# Altium schematic sheet 03_Clock_Diagram.SchDoc: Clock diagram
size A4; Organization: Lime Microsystems; Address1: Surrey Tech Centre; Address2: Guildford GU2 7YG; Address3: Surrey; Address4: United Kingdom; Revision: v2.3; SheetNumber: 3; SheetTotal: 10
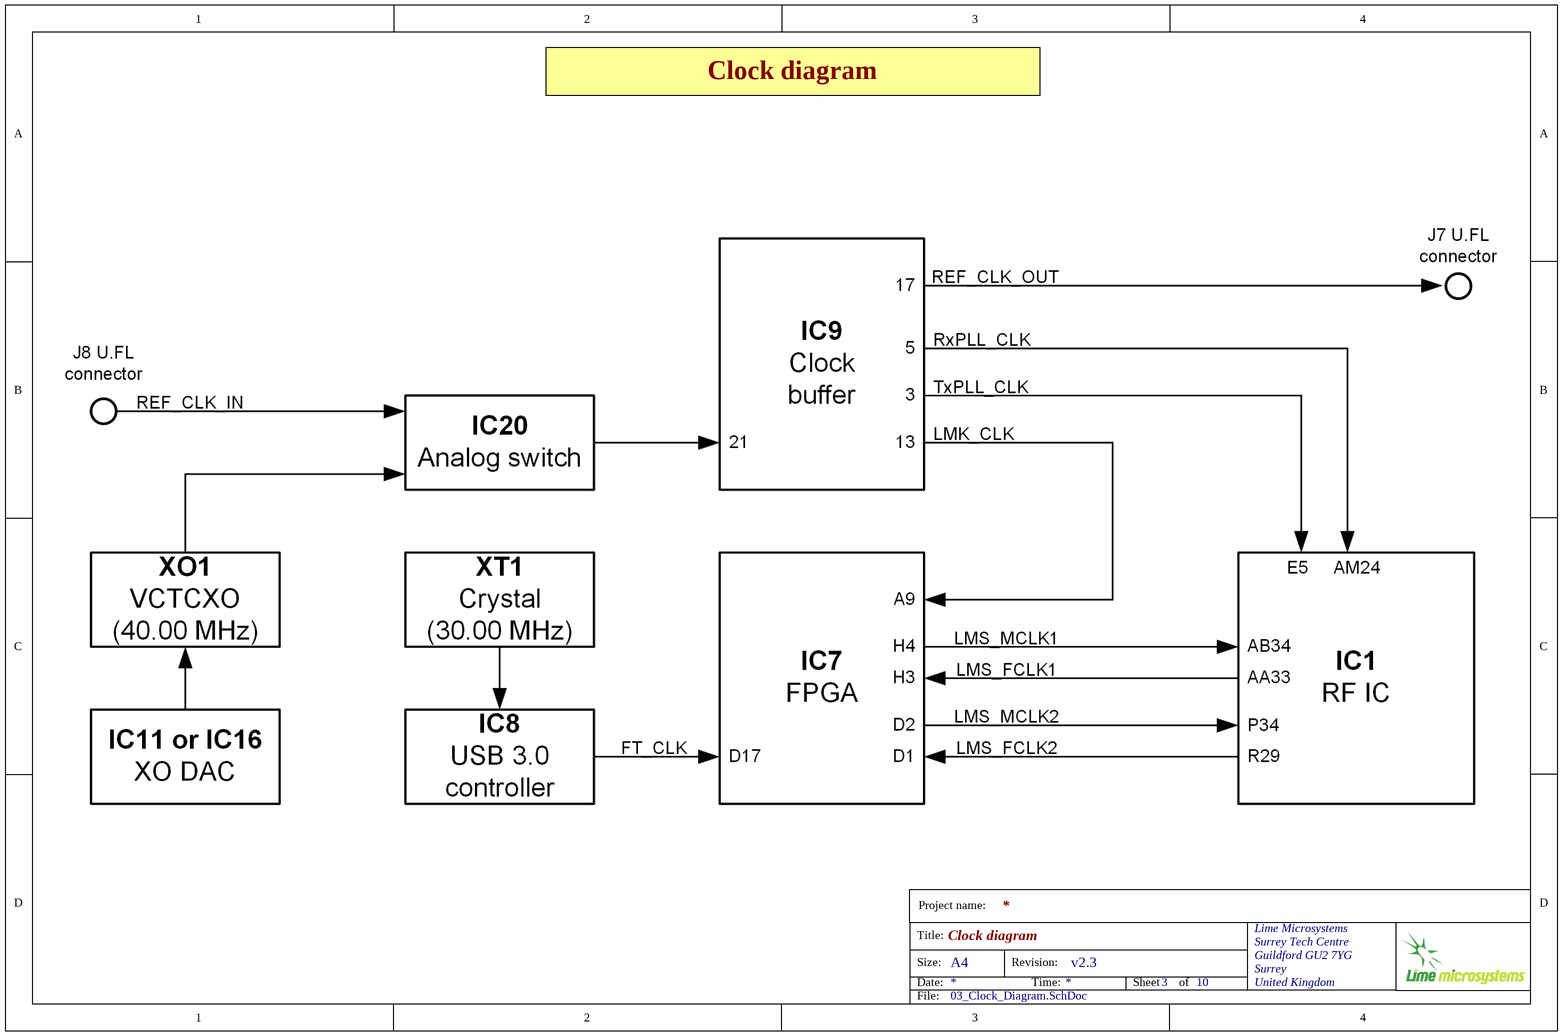
[diagram p0: 03_Clock_Diagram.SchDoc]

## Notes on the sheet
- Clock diagram
- Project name:
- Title:
- Size:
- Date:
- A4
- Revision:
- Time:
- Sheet
- of
- File: